# Altium schematic sheet CLKB_uplink_phy_and_sfp_1221.SchDoc
size A3
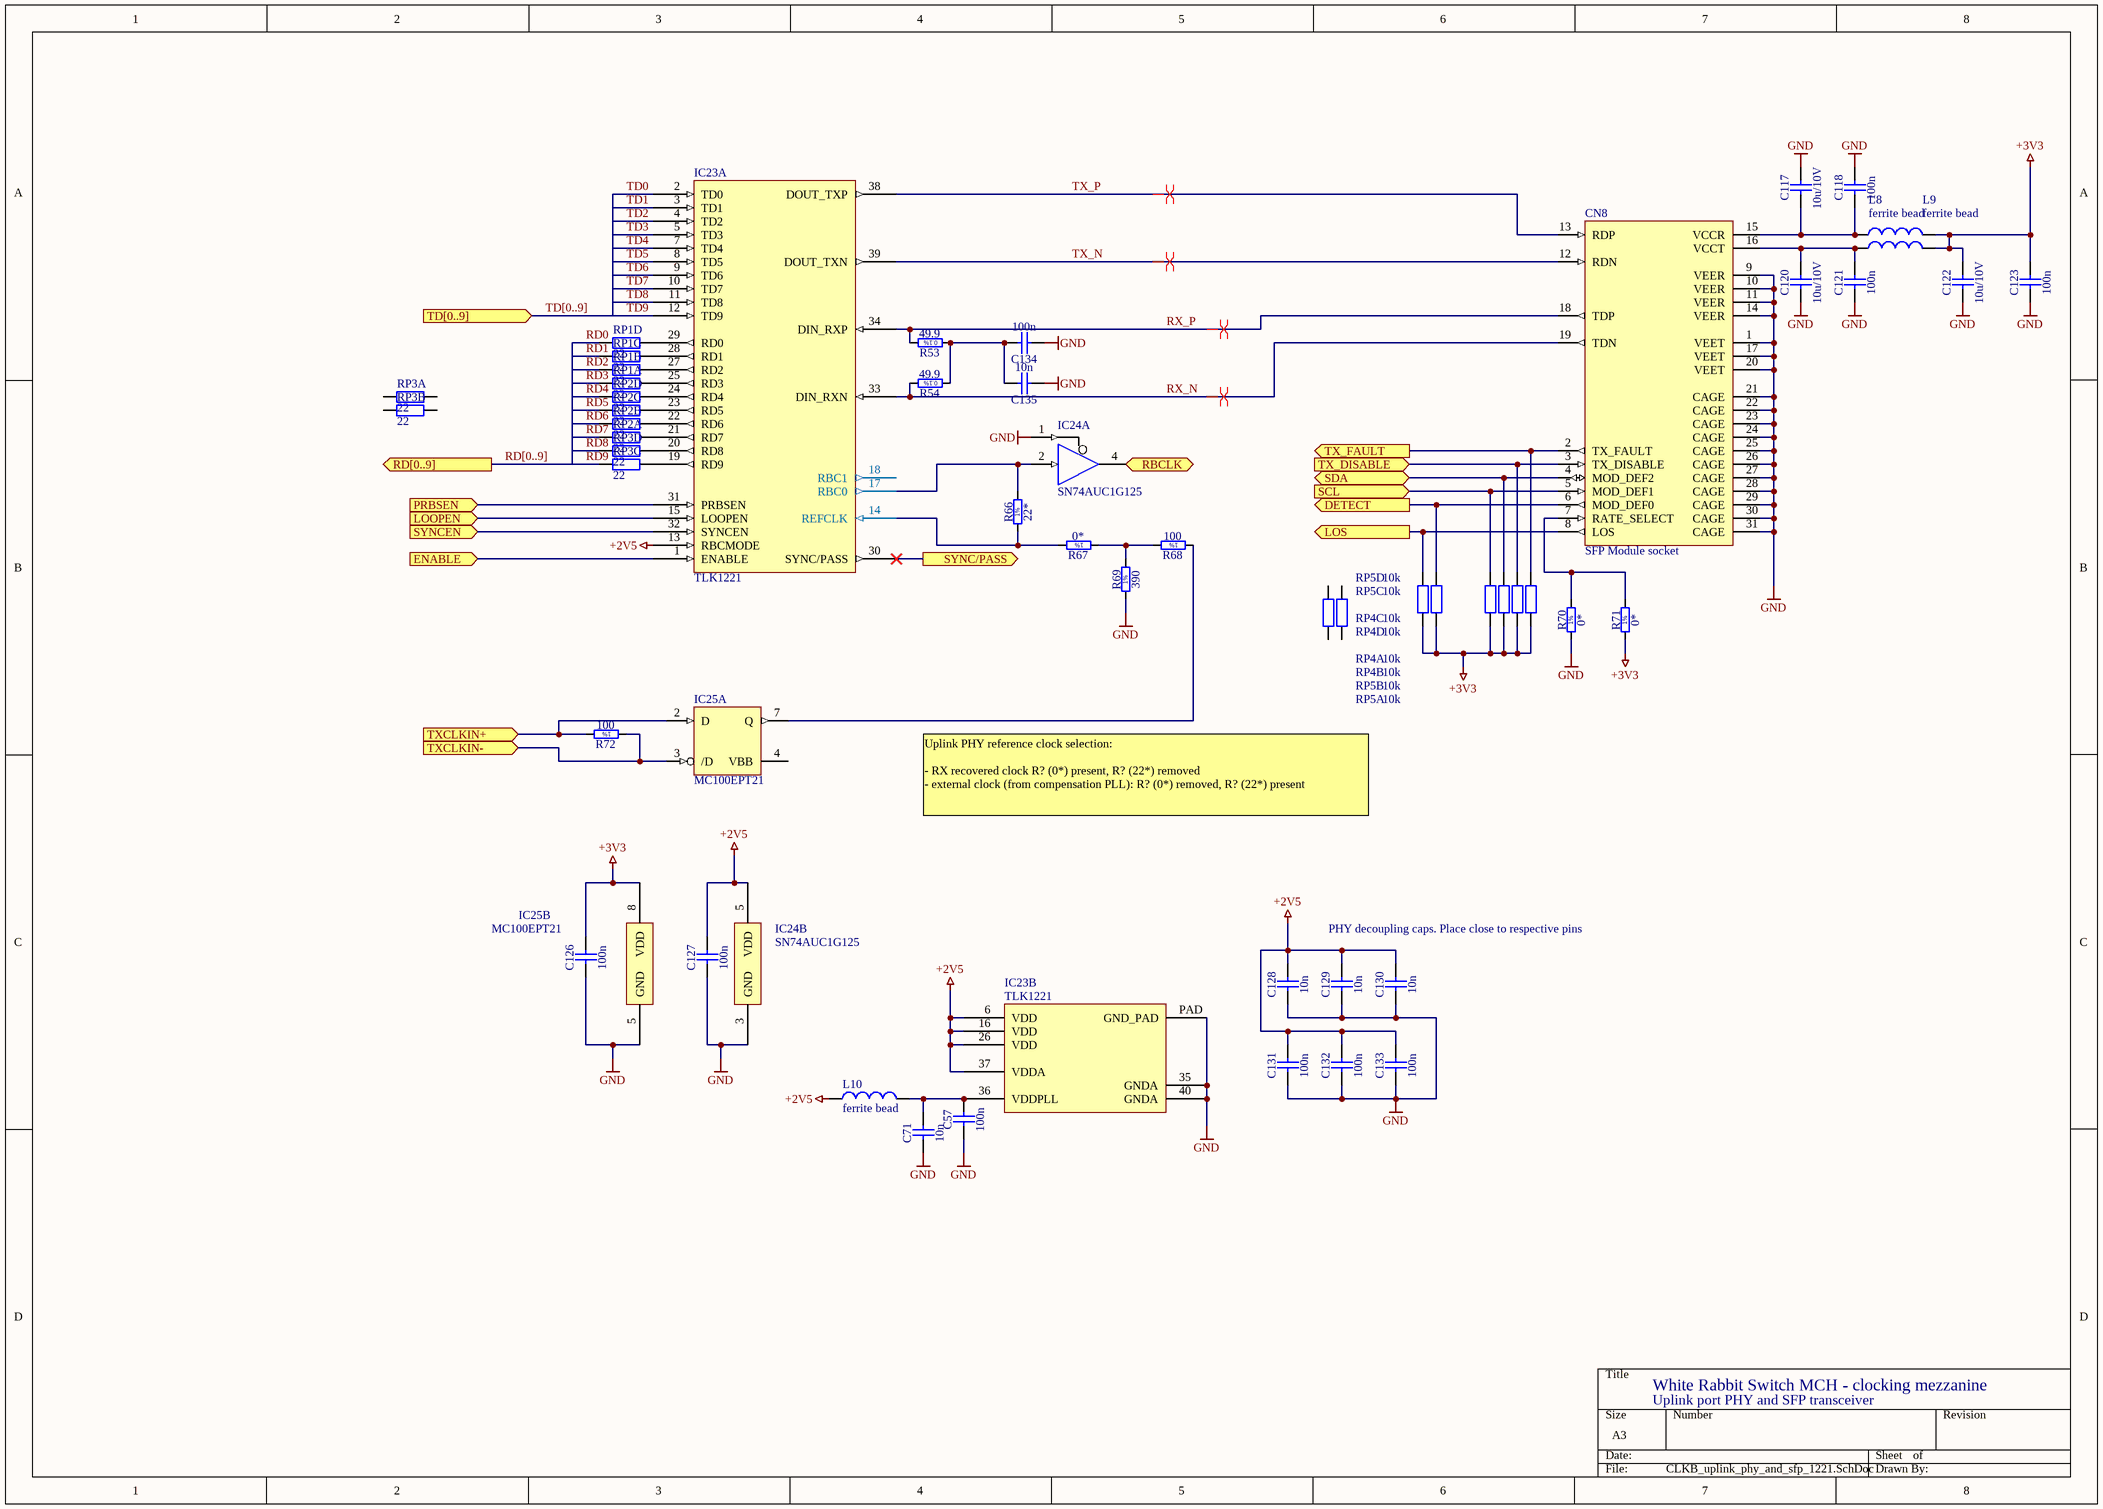
[diagram p0: CLKB_uplink_phy_and_sfp_1221.SchDoc]

## Parts
C57  100n  [CAPC1608X87N]
C71  10n  [CAPC1608X87N]
C117  10u/10V  [CAPC3216X140N]
C118  100n  [CAPC1608X87N]
C120  10u/10V  [CAPC3216X140N]
C121  100n  [CAPC1608X87N]
C122  10u/10V  [CAPC3216X140N]
C123  100n  [CAPC1608X87N]
C126  100n  [CAPC1608X87N]
C127  100n  [CAPC1608X87N]
C128  10n  [CAPC1608X87N]
C129  10n  [CAPC1608X87N]
C130  10n  [CAPC1608X87N]
C131  100n  [CAPC1608X87N]
C132  100n  [CAPC1608X87N]
C133  100n  [CAPC1608X87N]
C134  100n  [CAPC1608X87N]
C135  10n  [CAPC1608X87N]
CN8  SFP Module socket  [SFP_SINGLE_PORT]
IC23  TLK1221  [QFN40_powerpad]  (parts A,B of 2)
IC24  SN74AUC1G125  [SOT23-5AL]  (parts A,B of 2)
IC25  MC100EPT21  [TSOP65P490-8AN]  (parts A,B of 2)
L8  value ferrite bead  [INDC2012-0805]  (hidden comment: Inductor)
L9  value ferrite bead  [INDC2012-0805]  (hidden comment: Inductor)
L10  value ferrite bead  [INDC2012-0805]  (hidden comment: Inductor)
R53  49.9  [RESC1608X55N]
R54  49.9  [RESC1608X55N]
R66  22*  [RESC1608X55N]
R67  0*  [RESC1608X55N]
R68  100  [RESC1608X55N]
R69  390  [RESC1608X55N]
R70  0*  [RESC1608X55N]
R71  0*  [RESC1608X55N]
R72  100  [RESC1608X55N]
RP1  value 22  [YC124]  (hidden comment: RES_PACK)  (parts A,B,C,D of 4)
RP2  value 22  [YC124]  (hidden comment: RES_PACK)  (parts A,B,C,D of 4)
RP3  value 22  [YC124]  (hidden comment: RES_PACK)  (parts A,B,C,D of 4)
RP4  value 10k  [YC124]  (hidden comment: RES_PACK)  (parts A,B,C,D of 4)
RP5  value 10k  [YC124]  (hidden comment: RES_PACK)  (parts A,B,C,D of 4)

## Ports
DETECT (out), ENABLE (in), LOOPEN (in), LOS (out), PRBSEN (in), RBCLK (out), RD[0..9] (out), SCL (in), SDA (bidir), SYNC/PASS (out), SYNCEN (in), TD[0..9] (in), TX_DISABLE (in), TX_FAULT (out), TXCLKIN+ (in), TXCLKIN- (in)

## Nets
+2V5: C127.2 C128.2 C129.2 C130.2 C131.2 C132.2 C133.2 IC23.6(VDD) IC23.13(RBCMODE) IC23.16(VDD) IC23.26(VDD) IC23.37(VDDA) IC24.5(VDD) L10.2
+3V3: C122.2 C123.2 C126.2 IC25.8(VDD) L8.2 L9.2 R71.1 RP4.1(A) RP4.2(A) RP4.3(A) RP4.4(A) RP5.1(A) RP5.2(A)
GND: C57.1 C71.1 C117.2 C118.2 C120.1 C121.1 C122.1 C123.1 C126.1 C127.1 C128.1 C129.1 C130.1 C131.1 C132.1 C133.1 C134.1 C135.1 CN8.1(VEET) CN8.9(VEER) CN8.10(VEER) CN8.11(VEER) CN8.14(VEER) CN8.17(VEET) CN8.20(VEET) CN8.21(CAGE) CN8.22(CAGE) CN8.23(CAGE) CN8.24(CAGE) CN8.25(CAGE) CN8.26(CAGE) CN8.27(CAGE) CN8.28(CAGE) CN8.29(CAGE) CN8.30(CAGE) CN8.31(CAGE) IC23.35(GNDA) IC23.40(GNDA) IC23.PAD(GND_PAD) IC24.1(~{OE}) IC24.3(GND) IC25.5(GND) R69.1 R70.1
DETECT: CN8.6(MOD_DEF0) RP4.6(B) ; port DETECT
ENABLE: IC23.1(ENABLE) ; port ENABLE
LOOPEN: IC23.15(LOOPEN) ; port LOOPEN
LOS: CN8.8(LOS) RP4.5(B) ; port LOS
PRBSEN: IC23.31(PRBSEN) ; port PRBSEN
RBCLK: IC24.4(Y) ; port RBCLK
RD0: RP1.4(A)
RD1: RP1.3(A)
RD2: RP1.2(A)
RD3: RP1.1(A)
RD4: RP2.4(A)
RD5: RP2.3(A)
RD6: RP2.2(A)
RD7: RP2.1(A)
RD8: RP3.4(A)
RD9: RP3.3(A)
RX_N: CN8.19(TDN) IC23.33(DIN_RXN) R54.2
RX_P: CN8.18(TDP) IC23.34(DIN_RXP) R53.2
SCL: CN8.5(MOD_DEF1) RP4.7(B) ; port SCL
SDA: CN8.4(MOD_DEF2) RP4.8(B) ; port SDA
SYNC/PASS: IC23.30(SYNC/PASS) ; port SYNC/PASS
SYNCEN: IC23.32(SYNCEN) ; port SYNCEN
TD0: IC23.2(TD0)
TD1: IC23.3(TD1)
TD2: IC23.4(TD2)
TD3: IC23.5(TD3)
TD4: IC23.7(TD4)
TD5: IC23.8(TD5)
TD6: IC23.9(TD6)
TD7: IC23.10(TD7)
TD8: IC23.11(TD8)
TD9: IC23.12(TD9)
TX_DISABLE: CN8.3(TX_DISABLE) RP5.7(B) ; port TX_DISABLE
TX_FAULT: CN8.2(TX_FAULT) RP5.8(B) ; port TX_FAULT
TX_N: CN8.12(RDN) IC23.39(DOUT_TXN)
TX_P: CN8.13(RDP) IC23.38(DOUT_TXP)
TXCLKIN+: IC25.2(D) R72.2 ; port TXCLKIN+
TXCLKIN-: IC25.3(/D) R72.1 ; port TXCLKIN-
NetC57_2: C57.2 C71.2 IC23.36(VDDPLL) L10.1
NetC117_1: C117.1 C118.1 CN8.15(VCCR) L9.1
NetC120_2: C120.2 C121.2 CN8.16(VCCT) L8.1
NetC134_2: C134.2 C135.2 R53.1 R54.1
NetCN8_7: CN8.7(RATE_SELECT) R70.2 R71.2
NetIC23_14: IC23.14(REFCLK) R66.1 R67.2
NetIC23_17: IC23.17(RBC0) IC24.2(A) R66.2
NetIC23_19: IC23.19(RD9) RP3.6(B)
NetIC23_20: IC23.20(RD8) RP3.5(B)
NetIC23_21: IC23.21(RD7) RP2.8(B)
NetIC23_22: IC23.22(RD6) RP2.7(B)
NetIC23_23: IC23.23(RD5) RP2.6(B)
NetIC23_24: IC23.24(RD4) RP2.5(B)
NetIC23_25: IC23.25(RD3) RP1.8(B)
NetIC23_27: IC23.27(RD2) RP1.7(B)
NetIC23_28: IC23.28(RD1) RP1.6(B)
NetIC23_29: IC23.29(RD0) RP1.5(B)
NetIC25_7: IC25.7(Q) R68.1
NetR67_1: R67.1 R68.2 R69.2

Not connected (* = marked no-connect by the designer): IC23 18(RBC1); IC25 4(VBB); RP3 1(A) 2(A) 7(B) 8(B); RP5 3(A) 4(A) 5(B) 6(B)

## Buses and harness runs
bus RD[0..9] = port RD[0..9]
bus TD[0..9] = port TD[0..9]

## Layout directives
differential pair: RX_N, RX_P, TX_N, TX_P

## Notes on the sheet
- Uplink PHY reference clock selection:
  - RX recovered clock R? (0*) present, R? (22*) removed
  - external clock (from compensation PLL): R? (0*) removed, R? (22*) present
- PHY decoupling caps. Place close to respective pins
- White Rabbit Switch MCH - clocking mezzanine
- Uplink port PHY and SFP transceiver
- (in symbol R0603_0R_JUMPER) 1%
- (in symbol R0603_22R_1%_0.1W_100PPM) 1%
- (in symbol R0603_49R9_0.1%_0.063W_10PPM) 0.1%
- (in symbol R0603_100R_1%_0.1W_100PPM) 1%
- (in symbol R0603_390R_1%_0.1W_100PPM) 1%

## Library data of the parts
C57 C118 C121 C123 C126 C127 C131-C134 = CC0603_100NF_50V_10%_X7R: Non-polarised capacitor; Part Description: SMD Multilayer Chip Ceramic Capacitor; Manufacturer: GENERIC; Manufacturer1 Part Number: 223858615649; Manufacturer1 Datasheet: \\cern.ch\dfs\Applications\Altium\Datasheets\CC0603_X7R_PHYCOMP.pdf; Value: 100nF; Voltage: 50V; TC: X7R; Tolerance: ±10%; Table: Capacitors SMD; Part Number: CC0603_100NF_50V_10%_X7R; Component Kind: Standard; Component Type: Standard; Designator: Capacitor - non polarized; Library Reference: Capacitor - non polarized; Pin Count: 2; Status: Preferred; Manufacturer Part Number: CC0603_100NF_50V_10%_X7R; Case: 0603; Mounted: Yes; Socket: No; SMD: Yes; Manufacturer1 Example: PHYCOMP; Manufacturer1 ComponentHeight: 0.87mm; HelpURL: \\cern.ch\dfs\Applications\Altium\Datasheets\CC0603_X7R_PHYCOMP.pdf; Author: CERN DEM JLC; CreateDate: 12/3/2007; LatestRevisionDate: 12/3/2007
C71 C128-C130 C135 = CC0603_10NF_50V_10%_X7R: Non-polarised capacitor; Part Description: SMD Multilayer Chip Ceramic Capacitor; Manufacturer: GENERIC; Manufacturer1 Part Number: 223858615636; Manufacturer1 Datasheet: \\cern.ch\dfs\Applications\Altium\Datasheets\CC0603_X7R_PHYCOMP.pdf; Value: 10nF; Voltage: 50V; TC: X7R; Tolerance: ±10%; Table: Capacitors SMD; Part Number: CC0603_10NF_50V_10%_X7R; Component Kind: Standard; Component Type: Standard; Designator: Capacitor - non polarized; Library Reference: Capacitor - non polarized; Pin Count: 2; Status: Preferred; Manufacturer Part Number: CC0603_10NF_50V_10%_X7R; Case: 0603; Mounted: Yes; Socket: No; SMD: Yes; Manufacturer1 Example: PHYCOMP; Manufacturer1 ComponentHeight: 0.87mm; HelpURL: \\cern.ch\dfs\Applications\Altium\Datasheets\CC0603_X7R_PHYCOMP.pdf; Author: CERN DEM JLC; CreateDate: 12/3/2007; LatestRevisionDate: 12/3/2007
C117 C120 C122 = CC1206_10UF_10V_10%_X7R: Non-polarised capacitor; Part Description: SMD Multilayer Chip Ceramic Capacitor; Manufacturer: GENERIC; Manufacturer1 Part Number: C1206C106K8RAC; Manufacturer1 Datasheet: \\cern.ch\dfs\Applications\Altium\Datasheets\CC1206_X7R_KEMET.pdf; Value: 10uF; Voltage: 10V; TC: X7R; Tolerance: ±10%; Table: Capacitors SMD; Part Number: CC1206_10UF_10V_10%_X7R; Component Kind: Standard; Component Type: Standard; Designator: Capacitor - non polarized; Library Reference: Capacitor - non polarized; Pin Count: 2; Status: Preferred; Manufacturer Part Number: CC1206_10uF_10V_10%_X7R; Case: 1206; Mounted: Yes; Socket: No; SMD: Yes; Manufacturer1 Example: KEMET; Manufacturer1 ComponentHeight: 1.8mm; HelpURL: \\cern.ch\dfs\Applications\Altium\Datasheets\CC1206_X7R_KEMET.pdf; Author: CERN DEM JLC; CreateDate: 12/3/2007; LatestRevisionDate: 12/3/2007
CN8 = SFP_SOCKET_SINGLE: Socket for SFP module
IC23 = TLK1221: Texas Instruments Gigabit Ethernet PHY with deterministic clocking and LVPECL output interface; RefId: 1576976; Value: TLK1221RHAT; Supplier: Farnell
IC24 = SN74AUC1G125: TI 2.5V single tri-state buffer; RefId: 1606269; Value: SN74AUC1G125DBVR; Supplier: Farnell
IC25 = MC100EPT21: ONSemi LVDS/LVPECL -> LVTTL/LVCMOS buffer; RefId: MC100EPT21DTGOS-ND; Supplier: Digikey; Value: MC100EPT21
L8-L10 = Inductor: Ferrite bead; Published: 8-Jun-2000; Revision: July-2002: Re-released for DXP Platform.; Publisher: Altium Limited
R53 R54 = R0603_49R9_0.1%_0.063W_10PPM: Resistor - 0.1%; Part Description: Thin Film Chip Resistor; Manufacturer: GENERIC; Manufacturer1 Part Number: RN73C1J49R9BTDF; Manufacturer1 Datasheet: \\cern.ch\dfs\Applications\Altium\Datasheets\R0603_Tyco_RN73.pdf; Value: 49R9; Power: 0.063W; TC: ±10ppm; Table: Resistors SMD; Part Number: R0603_49R9_0.1%_0.063W_10PPM; Component Kind: Standard; Component Type: Standard; Designator: Resistor - 0.1%; Library Reference: Resistor - 0.1%; Pin Count: 2; Status: Not recommended; Tolerance: ±0.1%; Manufacturer Part Number: R0603_49R9_0.1%_0.063W_10PPM; Case: 0603; Mounted: Yes; Socket: No; SMD: Yes; Manufacturer1 Example: TYCO HOLSWORTHY; Manufacturer1 ComponentHeight: 0.5mm; HelpURL: \\cern.ch\dfs\Applications\Altium\Datasheets\R0603_Tyco_RN73.pdf; Author: CERN DEM JLC; CreateDate: 12/3/2007; LatestRevisionDate: 3/13/2008
R66 = R0603_22R_1%_0.1W_100PPM: Resistor - 1%; Part Description: General Purpose Thick Film Chip Resistor; Manufacturer: GENERIC; Manufacturer1 Part Number: NRC06F22R0TRF; Manufacturer1 Datasheet: \\cern.ch\dfs\Applications\Altium\Datasheets\R0603_NIC_NRC.pdf; Value: 22; Power: 0.1W; TC: ±100ppm/°C; Table: Resistors SMD; Part Number: R0603_22R_1%_0.1W_100PPM; Component Kind: Standard; Component Type: Standard; Designator: Resistor - 1%; Library Reference: Resistor - 1%; Pin Count: 2; Status: Preferred; Tolerance: ±1%; Manufacturer Part Number: R0603_22R_1%_0.1W_100PPM; Case: 0603; Mounted: Yes; Socket: No; SMD: Yes; Manufacturer1 Example: NIC COMPONENT; Manufacturer1 ComponentHeight: 0.55mm; HelpURL: \\cern.ch\dfs\Applications\Altium\Datasheets\R0603_NIC_NRC.pdf; Author: CERN DEM JLC; CreateDate: 12/3/2007; LatestRevisionDate: 3/13/2008
R67 R70 R71 = R0603_0R_JUMPER: Resistor - 1%; Part Description: 1A (0.05R Max DC Resistance) Zero Ohm Jumper; Manufacturer: GENERIC; Manufacturer1 Part Number: NRC06Z0; Manufacturer1 Datasheet: \\cern.ch\dfs\Applications\Altium\Datasheets\R0603_NIC_NRC.pdf; Value: 0; Table: Resistors SMD; Part Number: R0603_0R_JUMPER; Component Kind: Standard; Component Type: Standard; Designator: Resistor - 1%; Library Reference: Resistor - 1%; Pin Count: 2; Status: Preferred; Manufacturer Part Number: R0603_0R_JUMPER; Case: 0603; Mounted: Yes; Socket: No; SMD: Yes; Manufacturer1 Example: NIC COMPONENT; Manufacturer1 ComponentHeight: 0.55mm; HelpURL: \\cern.ch\dfs\Applications\Altium\Datasheets\R0603_NIC_NRC.pdf; Author: CERN DEM JLC; CreateDate: 12/3/2007; LatestRevisionDate: 3/13/2008
R68 R72 = R0603_100R_1%_0.1W_100PPM: Resistor - 1%; Part Description: General Purpose Thick Film Chip Resistor; Manufacturer: GENERIC; Manufacturer1 Part Number: NRC06F4700TRF; Manufacturer1 Datasheet: \\cern.ch\dfs\Applications\Altium\Datasheets\R0603_NIC_NRC.pdf; Power: 0.1W; TC: ±100ppm/°C; Table: Resistors SMD; Part Number: R0603_100R_1%_0.1W_100PPM; Component Kind: Standard; Component Type: Standard; Designator: Resistor - 1%; Library Reference: Resistor - 1%; Pin Count: 2; Value: 100; Status: Preferred; Tolerance: ±1%; Manufacturer Part Number: R0603_100R_1%_0.1W_100PPM; Case: 0603; Mounted: Yes; Socket: No; SMD: Yes; Manufacturer1 Example: NIC COMPONENT; Manufacturer1 ComponentHeight: 0.55mm; HelpURL: \\cern.ch\dfs\Applications\Altium\Datasheets\R0603_NIC_NRC.pdf; Author: CERN DEM JLC; CreateDate: 12/3/2007; LatestRevisionDate: 3/13/2008
R69 = R0603_390R_1%_0.1W_100PPM: Resistor - 1%; Part Description: General Purpose Thick Film Chip Resistor; Manufacturer: GENERIC; Manufacturer1 Part Number: NRC06F3900TRF; Manufacturer1 Datasheet: \\cern.ch\dfs\Applications\Altium\Datasheets\R0603_NIC_NRC.pdf; Power: 0.1W; TC: ±100ppm/°C; Table: Resistors SMD; Part Number: R0603_390R_1%_0.1W_100PPM; Component Kind: Standard; Component Type: Standard; Designator: Resistor - 1%; Library Reference: Resistor - 1%; Pin Count: 2; Value: 390; Status: Preferred; Tolerance: ±1%; Manufacturer Part Number: R0603_390R_1%_0.1W_100PPM; Case: 0603; Mounted: Yes; Socket: No; SMD: Yes; Manufacturer1 Example: NIC COMPONENT; Manufacturer1 ComponentHeight: 0.55mm; HelpURL: \\cern.ch\dfs\Applications\Altium\Datasheets\R0603_NIC_NRC.pdf; Author: CERN DEM JLC; CreateDate: 12/3/2007; LatestRevisionDate: 3/13/2008
RP1-RP3 = Res_Pack4_22R_YC124: 4-resistor pack; RefId: AVX  CRB2A4 series; Supplier: Farnell
RP4 RP5 = Res_Pack4_10k_YC124: 4-resistor pack; RefId: AVX  CRB2A4 series; Supplier: Farnell